# EAGLE schematic main (EAGLE 6.1)
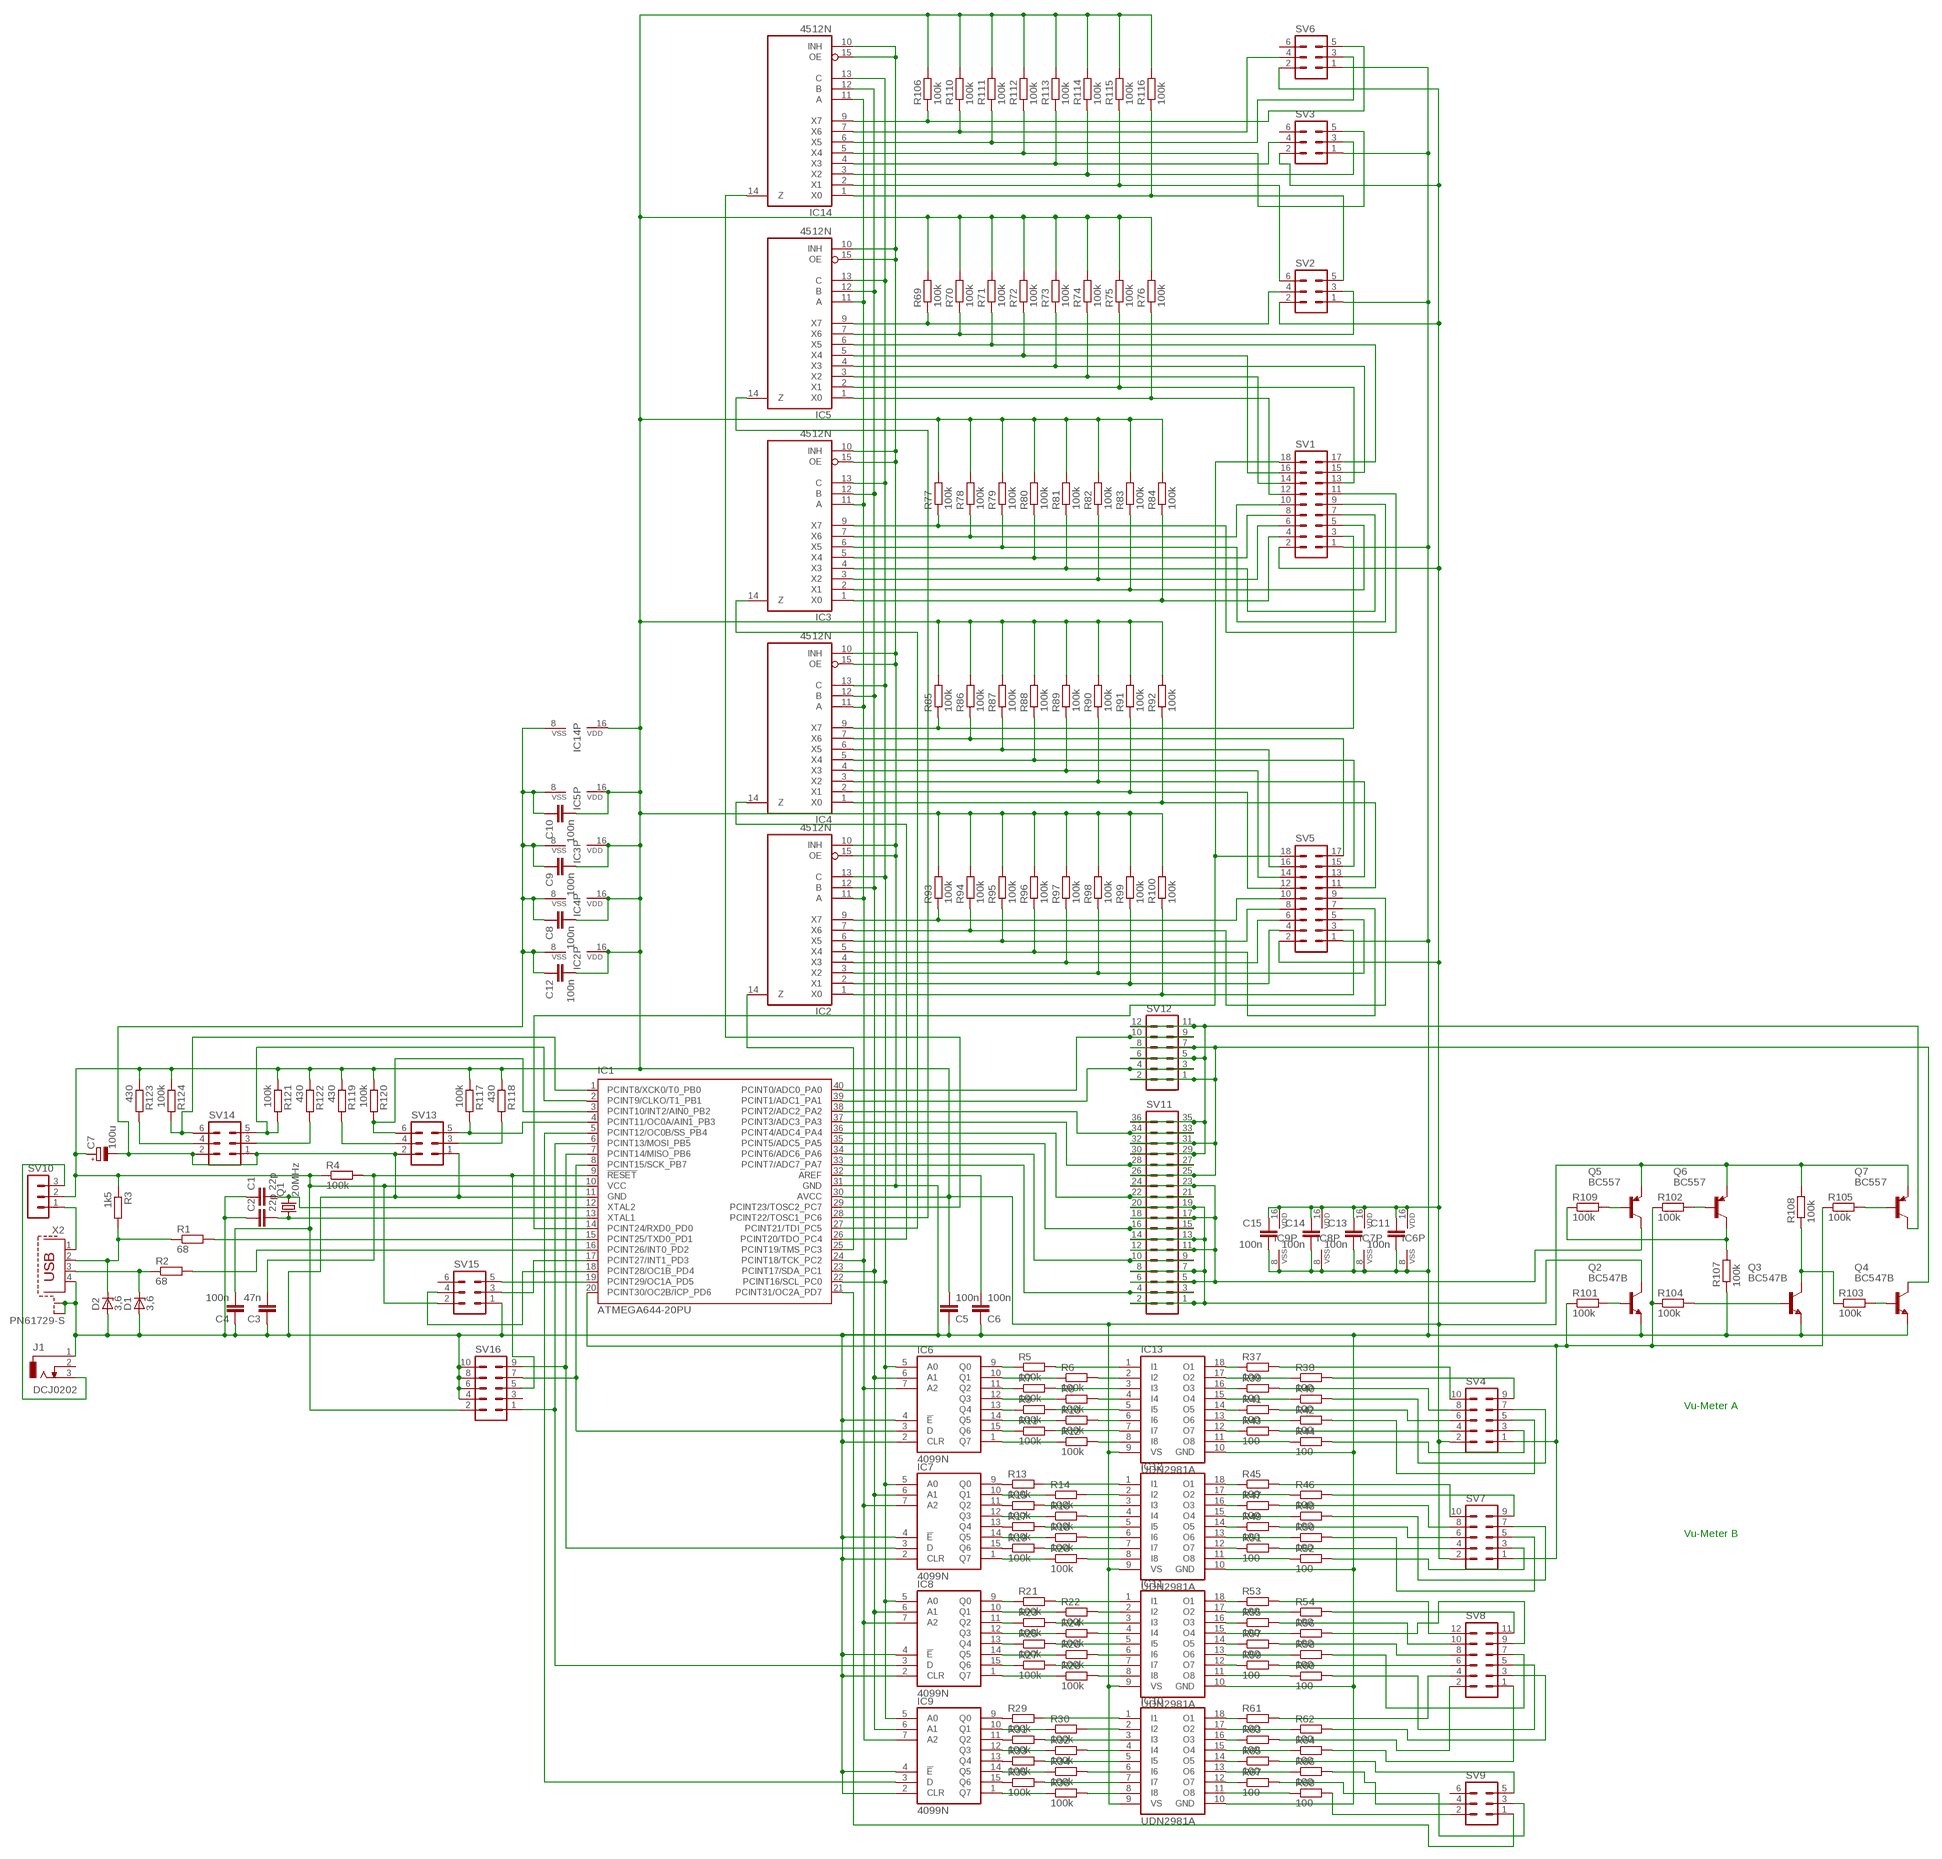
[diagram p0: schematic, sheet 1]

## Parts
C1  22p  C-EU025-024X044  [C025-024X044]
C2  22p  C-EU025-024X044  [C025-024X044]
C3  47n  C-EU025-024X044  [C025-024X044]
C4  100n  C-EU025-024X044  [C025-024X044]
C5  100n  C-EU025-024X044  [C025-024X044]
C6  100n  C-EU025-024X044  [C025-024X044]
C7  100u  CPOL-EUE3.5-8  [E3,5-8]
C8  100n  C-EU025-024X044  [C025-024X044]
C9  100n  C-EU025-024X044  [C025-024X044]
C10  100n  C-EU025-024X044  [C025-024X044]
C11  100n  C-EU025-024X044  [C025-024X044]
C12  100n  C-EU025-024X044  [C025-024X044]
C13  100n  C-EU025-024X044  [C025-024X044]
C14  100n  C-EU025-024X044  [C025-024X044]
C15  100n  C-EU025-024X044  [C025-024X044]
D1  3,6  ZENER-DIODEDO34-7  [DO34Z7]
D2  3,6  ZENER-DIODEDO34-7  [DO34Z7]
IC1  ATMEGA644-20PU  [DIL40]
IC2  4512N  [DIL16]
IC3  4512N  [DIL16]
IC4  4512N  [DIL16]
IC5  4512N  [DIL16]
IC6  4099N  [DIL16]
IC7  4099N  [DIL16]
IC8  4099N  [DIL16]
IC9  4099N  [DIL16]
IC10  UDN2981A  [DIL18]
IC11  UDN2981A  [DIL18]
IC12  UDN2981A  [DIL18]
IC13  UDN2981A  [DIL18]
IC14  4512N  [DIL16]
J1  DCJ0202  [DCJ0202]
Q1  20MHz  CRYSTALHC18U-V  [HC18U-V]
Q2  BC547B  [TO92]
Q3  BC547B  [TO92]
Q4  BC547B  [TO92]
Q5  BC557  [TO92]
Q6  BC557  [TO92]
Q7  BC557  [TO92]
R1  68  R-EU_0204/7  [0204/7]
R2  68  R-EU_0204/7  [0204/7]
R3  1k5  R-EU_0204/7  [0204/7]
R4  100k  R-EU_0204/7  [0204/7]
R5  100k  R-EU_0204/7  [0204/7]
R6  100k  R-EU_0204/7  [0204/7]
R7  100k  R-EU_0204/7  [0204/7]
R8  100k  R-EU_0204/7  [0204/7]
R9  100k  R-EU_0204/7  [0204/7]
R10  100k  R-EU_0204/7  [0204/7]
R11  100k  R-EU_0204/7  [0204/7]
R12  100k  R-EU_0204/7  [0204/7]
R13  100k  R-EU_0204/7  [0204/7]
R14  100k  R-EU_0204/7  [0204/7]
R15  100k  R-EU_0204/7  [0204/7]
R16  100k  R-EU_0204/7  [0204/7]
R17  100k  R-EU_0204/7  [0204/7]
R18  100k  R-EU_0204/7  [0204/7]
R19  100k  R-EU_0204/7  [0204/7]
R20  100k  R-EU_0204/7  [0204/7]
R21  100k  R-EU_0204/7  [0204/7]
R22  100k  R-EU_0204/7  [0204/7]
R23  100k  R-EU_0204/7  [0204/7]
R24  100k  R-EU_0204/7  [0204/7]
R25  100k  R-EU_0204/7  [0204/7]
R26  100k  R-EU_0204/7  [0204/7]
R27  100k  R-EU_0204/7  [0204/7]
R28  100k  R-EU_0204/7  [0204/7]
R29  100k  R-EU_0204/7  [0204/7]
R30  100k  R-EU_0204/7  [0204/7]
R31  100k  R-EU_0204/7  [0204/7]
R32  100k  R-EU_0204/7  [0204/7]
R33  100k  R-EU_0204/7  [0204/7]
R34  100k  R-EU_0204/7  [0204/7]
R35  100k  R-EU_0204/7  [0204/7]
R36  100k  R-EU_0204/7  [0204/7]
R37  100  R-EU_0204/7  [0204/7]
R38  100  R-EU_0204/7  [0204/7]
R39  100  R-EU_0204/7  [0204/7]
R40  100  R-EU_0204/7  [0204/7]
R41  100  R-EU_0204/7  [0204/7]
R42  100  R-EU_0204/7  [0204/7]
R43  100  R-EU_0204/7  [0204/7]
R44  100  R-EU_0204/7  [0204/7]
R45  100  R-EU_0204/7  [0204/7]
R46  100  R-EU_0204/7  [0204/7]
R47  100  R-EU_0204/7  [0204/7]
R48  100  R-EU_0204/7  [0204/7]
R49  100  R-EU_0204/7  [0204/7]
R50  100  R-EU_0204/7  [0204/7]
R51  100  R-EU_0204/7  [0204/7]
R52  100  R-EU_0204/7  [0204/7]
R53  100  R-EU_0204/7  [0204/7]
R54  100  R-EU_0204/7  [0204/7]
R55  100  R-EU_0204/7  [0204/7]
R56  100  R-EU_0204/7  [0204/7]
R57  100  R-EU_0204/7  [0204/7]
R58  100  R-EU_0204/7  [0204/7]
R59  100  R-EU_0204/7  [0204/7]
R60  100  R-EU_0204/7  [0204/7]
R61  100  R-EU_0204/7  [0204/7]
R62  100  R-EU_0204/7  [0204/7]
R63  100  R-EU_0204/7  [0204/7]
R64  100  R-EU_0204/7  [0204/7]
R65  100  R-EU_0204/7  [0204/7]
R66  100  R-EU_0204/7  [0204/7]
R67  100  R-EU_0204/7  [0204/7]
R68  100  R-EU_0204/7  [0204/7]
R69  100k  R-EU_0204/7  [0204/7]
R70  100k  R-EU_0204/7  [0204/7]
R71  100k  R-EU_0204/7  [0204/7]
R72  100k  R-EU_0204/7  [0204/7]
R73  100k  R-EU_0204/7  [0204/7]
R74  100k  R-EU_0204/7  [0204/7]
R75  100k  R-EU_0204/7  [0204/7]
R76  100k  R-EU_0204/7  [0204/7]
R77  100k  R-EU_0204/7  [0204/7]
R78  100k  R-EU_0204/7  [0204/7]
R79  100k  R-EU_0204/7  [0204/7]
R80  100k  R-EU_0204/7  [0204/7]
R81  100k  R-EU_0204/7  [0204/7]
R82  100k  R-EU_0204/7  [0204/7]
R83  100k  R-EU_0204/7  [0204/7]
R84  100k  R-EU_0204/7  [0204/7]
R85  100k  R-EU_0204/7  [0204/7]
R86  100k  R-EU_0204/7  [0204/7]
R87  100k  R-EU_0204/7  [0204/7]
R88  100k  R-EU_0204/7  [0204/7]
R89  100k  R-EU_0204/7  [0204/7]
R90  100k  R-EU_0204/7  [0204/7]
R91  100k  R-EU_0204/7  [0204/7]
R92  100k  R-EU_0204/7  [0204/7]
R93  100k  R-EU_0204/7  [0204/7]
R94  100k  R-EU_0204/7  [0204/7]
R95  100k  R-EU_0204/7  [0204/7]
R96  100k  R-EU_0204/7  [0204/7]
R97  100k  R-EU_0204/7  [0204/7]
R98  100k  R-EU_0204/7  [0204/7]
R99  100k  R-EU_0204/7  [0204/7]
R100  100k  R-EU_0204/7  [0204/7]
R101  100k  R-EU_0204/7  [0204/7]
R102  100k  R-EU_0204/7  [0204/7]
R103  100k  R-EU_0204/7  [0204/7]
R104  100k  R-EU_0204/7  [0204/7]
R105  100k  R-EU_0204/7  [0204/7]
R106  100k  R-EU_0204/7  [0204/7]
R107  100k  R-EU_0204/7  [0204/7]
R108  100k  R-EU_0204/7  [0204/7]
R109  100k  R-EU_0204/7  [0204/7]
R110  100k  R-EU_0204/7  [0204/7]
R111  100k  R-EU_0204/7  [0204/7]
R112  100k  R-EU_0204/7  [0204/7]
R113  100k  R-EU_0204/7  [0204/7]
R114  100k  R-EU_0204/7  [0204/7]
R115  100k  R-EU_0204/7  [0204/7]
R116  100k  R-EU_0204/7  [0204/7]
R117  100k  R-EU_0204/7  [0204/7]
R118  430  R-EU_0204/7  [0204/7]
R119  430  R-EU_0204/7  [0204/7]
R120  100k  R-EU_0204/7  [0204/7]
R121  100k  R-EU_0204/7  [0204/7]
R122  430  R-EU_0204/7  [0204/7]
R123  430  R-EU_0204/7  [0204/7]
R124  100k  R-EU_0204/7  [0204/7]
SV1  MA09-2  [MA09-2]
SV2  MA03-2  [MA03-2]
SV3  MA03-2  [MA03-2]
SV4  MA05-2  [MA05-2]
SV5  MA09-2  [MA09-2]
SV6  MA03-2  [MA03-2]
SV7  MA05-2  [MA05-2]
SV8  MA06-2  [MA06-2]
SV9  MA03-2  [MA03-2]
SV10  MA03-1  [MA03-1]
SV11  MA18-2  [MA18-2]
SV12  MA06-2  [MA06-2]
SV13  MA03-2  [MA03-2]
SV14  MA03-2  [MA03-2]
SV15  MA03-2  [MA03-2]
SV16  MA05-2  [MA05-2]
X2  PN61729-S  [PN61729-S]

## Nets
GND [supply]: C1.1 C2.1 C3.1 C4.1 C5.1 C6.1 C7.- C8.1 C9.1 C10.1 C11.2 C12.1 C13.2 C14.2 C15.2 D1.A D2.A IC1.11(GND) IC1.31(GND) IC2.8(VSS) IC2.10(INH) IC2.15(OE) IC3.8(VSS) IC3.10(INH) IC3.15(OE) IC4.8(VSS) IC4.10(INH) IC4.15(OE) IC5.8(VSS) IC5.10(INH) IC5.15(OE) IC6.2(CLR) IC6.4(!E) IC6.8(VSS) IC7.2(CLR) IC7.4(!E) IC7.8(VSS) IC8.2(CLR) IC8.4(!E) IC8.8(VSS) IC9.2(CLR) IC9.4(!E) IC9.8(VSS) IC10.10(GND) IC11.10(GND) IC12.10(GND) IC13.10(GND) IC14.8(VSS) IC14.10(INH) IC14.15(OE) J1.1 Q2.1(E) Q3.1(E) Q4.1(E) R107.1 SV1.1 SV2.1 SV3.1 SV5.1 SV6.1 SV13.1 SV13.2 SV14.1 SV14.2 SV15.1 SV16.4 SV16.6 SV16.8 SV16.10 X2.4 X2.S1 X2.S2
N$1: IC4.9(X7) R85.1 SV1.3
N$2: C2.2 IC1.13(XTAL1) Q1.1
N$3: C1.2 IC1.12(XTAL2) Q1.2
N$4: IC1.14(PCINT24/RXD0_PD0) SV1.18 SV5.18
N$5: D1.C R2.1 X2.3
N$6: D2.C R1.1 R3.2 X2.2
N$7: IC1.16(PCINT26/INT0_PD2) R2.2
N$8: IC1.15(PCINT25/TXD0_PD1) R1.2
N$9: C3.2 IC1.9(!RESET) R4.2 SV16.5
N$10: IC7.9(Q0) R13.1
N$11: IC7.11(Q2) R15.1
N$12: C6.2 IC1.32(AREF)
N$13: IC7.13(Q4) R17.1
N$14: IC7.15(Q6) R19.1
N$15: IC1.6(PCINT13/MOSI_PB5) IC8.3(D) SV16.1
N$16: IC1.5(PCINT12/OC0B/SS_PB4) IC9.3(D)
N$17: IC1.23(PCINT17/SDA_PC1) IC2.12(B) IC3.12(B) IC4.12(B) IC5.12(B) IC6.6(A1) IC7.6(A1) IC8.6(A1) IC9.6(A1) IC14.12(B)
N$18: IC1.22(PCINT16/SCL_PC0) IC2.13(C) IC3.13(C) IC4.13(C) IC5.13(C) IC6.5(A0) IC7.5(A0) IC8.5(A0) IC9.5(A0) IC14.13(C)
N$19: IC1.24(PCINT18/TCK_PC2) IC2.11(A) IC3.11(A) IC4.11(A) IC5.11(A) IC6.7(A2) IC7.7(A2) IC8.7(A2) IC9.7(A2) IC14.11(A)
N$20: IC8.9(Q0) R21.1
N$21: IC8.10(Q1) R22.1
N$22: IC8.11(Q2) R23.1
N$23: IC8.12(Q3) R24.1
N$24: IC1.27(PCINT21/TDI_PC5) IC3.14(Z)
N$25: IC1.25(PCINT19/TMS_PC3) IC2.14(Z)
N$26: IC3.6(X5) R79.1 SV1.9
N$27: IC3.9(X7) R77.1 SV1.11
N$28: IC12.12(O7) R51.1
N$29: IC8.13(Q4) R25.1
N$30: IC8.14(Q5) R26.1
N$31: IC8.15(Q6) R27.1
N$32: IC8.1(Q7) R28.1
N$33: IC13.8(I8) R12.2
N$34: IC13.7(I7) R11.2
N$35: IC13.6(I6) R10.2
N$36: IC13.5(I5) R9.2
N$37: IC13.4(I4) R8.2
N$38: IC13.3(I3) R7.2
N$39: IC13.2(I2) R6.2
N$40: IC13.1(I1) R5.2
N$41: IC10.1(I1) R29.2
N$42: IC10.2(I2) R30.2
N$43: IC10.3(I3) R31.2
N$44: IC10.4(I4) R32.2
N$45: IC10.5(I5) R33.2
N$46: IC10.6(I6) R34.2
N$47: IC10.7(I7) R35.2
N$48: IC10.8(I8) R36.2
N$49: IC9.10(Q1) R30.1
N$50: IC9.12(Q3) R32.1
N$51: IC9.14(Q5) R34.1
N$52: IC9.1(Q7) R36.1
N$53: IC11.1(I1) R21.2
N$54: IC9.9(Q0) R29.1
N$55: IC9.11(Q2) R31.1
N$56: IC1.28(PCINT22/TOSC1_PC6) IC5.14(Z)
N$57: IC1.26(PCINT20/TDO_PC4) IC4.14(Z)
N$58: IC9.13(Q4) R33.1
N$59: IC11.2(I2) R22.2
N$60: IC9.15(Q6) R35.1
N$61: IC11.3(I3) R23.2
N$62: IC11.4(I4) R24.2
N$63: IC1.8(PCINT15/SCK_PB7) IC6.3(D) SV16.7
N$64: IC1.7(PCINT14/MISO_PB6) IC7.3(D) SV16.9
N$65: IC11.5(I5) R25.2
N$66: IC11.6(I6) R26.2
N$67: IC11.7(I7) R27.2
N$68: IC6.9(Q0) R5.1
N$69: IC6.10(Q1) R6.1
N$70: IC6.11(Q2) R7.1
N$71: IC6.12(Q3) R8.1
N$72: IC6.13(Q4) R9.1
N$73: IC6.14(Q5) R10.1
N$74: IC6.15(Q6) R11.1
N$75: IC6.1(Q7) R12.1
N$76: IC11.8(I8) R28.2
N$77: IC13.18(O1) R37.1
N$78: IC13.17(O2) R38.1
N$79: R37.2 SV4.10
N$80: R38.2 SV4.9
N$81: IC5.9(X7) R69.1 SV2.4
N$82: R53.2 SV8.12
N$83: R39.2 SV4.8
N$84: IC12.1(I1) R13.2
N$85: IC12.2(I2) R14.2
N$86: IC12.3(I3) R15.2
N$87: IC12.4(I4) R16.2
N$88: IC12.5(I5) R17.2
N$89: IC12.6(I6) R18.2
N$90: IC12.7(I7) R19.2
N$91: IC12.8(I8) R20.2
N$92: IC7.10(Q1) R14.1
N$93: IC7.12(Q3) R16.1
N$94: IC13.16(O3) R39.1
N$95: IC13.15(O4) R40.1
N$96: R40.2 SV4.7
N$97: R41.2 SV4.6
N$98: IC5.6(X5) R71.1 SV1.17
N$99: IC7.14(Q5) R18.1
N$100: IC7.1(Q7) R20.1
N$101: IC3.4(X3) R81.1 SV1.7
N$102: IC13.14(O5) R41.1
N$103: IC13.13(O6) R42.1
N$104: R42.2 SV4.5
N$105: R43.2 SV4.4
N$106: IC5.4(X3) R73.1 SV1.15
N$107: IC3.2(X1) R83.1 SV1.5
N$108: IC13.12(O7) R43.1
N$109: IC13.11(O8) R44.1
N$110: IC12.13(O6) R50.1
N$111: IC5.2(X1) R75.1 SV1.13
N$112: R54.2 SV8.11
N$113: IC3.3(X2) R82.1 SV1.6
N$114: IC12.18(O1) R45.1
N$115: IC12.17(O2) R46.1
N$116: R44.2 SV4.3
N$117: J1.3 SV10.3
N$118: IC12.16(O3) R47.1
N$119: IC12.15(O4) R48.1
N$120: R45.2 SV7.10
N$121: R46.2 SV7.9
N$122: IC12.14(O5) R49.1
N$123: IC11.12(O7) R59.1
N$124: R47.2 SV7.8
N$125: R48.2 SV7.7
N$126: R55.2 SV8.10
N$127: R49.2 SV7.6
N$128: R50.2 SV7.5
N$129: IC12.11(O8) R52.1
N$130: R51.2 SV7.4
N$131: IC11.18(O1) R53.1
N$132: IC11.17(O2) R54.1
N$133: R52.2 SV7.3
N$134: IC5.7(X6) R70.1 SV2.3
N$135: IC11.16(O3) R55.1
N$136: IC11.15(O4) R56.1
N$137: IC1.33(PCINT7/ADC7_PA7) SV11.3 SV11.4
N$138: IC3.1(X0) R84.1 SV1.4
N$139: IC11.14(O5) R57.1
N$140: IC11.13(O6) R58.1
N$141: R56.2 SV8.9
N$142: R57.2 SV8.8
N$143: R58.2 SV8.7
N$144: R59.2 SV8.6
N$145: R60.2 SV8.5
N$146: IC11.11(O8) R60.1
N$147: R61.2 SV8.4
N$148: IC10.18(O1) R61.1
N$149: IC10.17(O2) R62.1
N$150: R62.2 SV8.3
N$151: IC1.34(PCINT6/ADC6_PA6) SV11.9 SV11.10
N$152: IC10.16(O3) R63.1
N$153: IC10.15(O4) R64.1
N$154: IC4.7(X6) R86.1 SV5.17
N$155: IC4.6(X5) R87.1 SV5.16
N$156: IC10.14(O5) R65.1
N$157: IC10.13(O6) R66.1
N$158: IC4.5(X4) R88.1 SV5.15
N$159: IC4.4(X3) R89.1 SV5.14
N$160: IC10.12(O7) R67.1
N$161: IC4.3(X2) R90.1 SV5.13
N$162: IC1.29(PCINT23/TOSC2_PC7) IC14.14(Z)
N$163: IC10.11(O8) R68.1
N$164: IC5.5(X4) R72.1 SV1.16
N$165: IC4.2(X1) R91.1 SV5.12
N$166: R63.2 SV8.2
N$167: IC4.1(X0) R92.1 SV5.11
N$168: IC2.9(X7) R93.1 SV5.10
N$169: IC2.7(X6) R94.1 SV5.9
N$170: IC2.6(X5) R95.1 SV5.8
N$171: IC14.9(X7) R106.1 SV6.5
N$172: IC2.5(X4) R96.1 SV5.7
N$173: IC14.7(X6) R110.1 SV6.4
N$174: IC14.6(X5) R111.1 SV6.3
N$175: IC14.4(X3) R113.1 SV3.4
N$176: IC14.2(X1) R115.1 SV2.6
N$177: IC2.4(X3) R97.1 SV5.6
N$178: IC2.3(X2) R98.1 SV5.5
N$179: R64.2 SV8.1
N$180: IC2.2(X1) R99.1 SV5.4
N$181: R65.2 SV9.5
N$182: IC2.1(X0) R100.1 SV5.3
N$183: R66.2 SV9.4
N$184: IC3.7(X6) R78.1 SV1.10
N$185: IC1.20(PCINT30/OC2B/ICP_PD6) R101.1 R102.1 R104.1 R105.1 SV4.1 SV7.1
N$186: Q6.2(B) R102.2
N$187: R67.2 SV9.3
N$188: IC14.5(X4) R112.1 SV3.5
N$189: Q7.2(B) R105.2
N$190: IC14.3(X2) R114.1 SV3.3
N$191: IC14.1(X0) R116.1 SV2.5
N$192: Q2.2(B) R101.2
N$193: R68.2 SV9.2
N$194: IC3.5(X4) R80.1 SV1.8
N$195: Q3.2(B) R104.2
N$196: Q6.3(C) R107.2 R109.1
N$197: Q3.3(C) R103.1 R108.1
N$198: Q4.2(B) R103.2
N$199: Q5.2(B) R109.2
N$200: IC1.21(PCINT31/OC2A_PD7) SV9.1
N$201: IC1.4(PCINT11/OC0A/AIN1_PB3) R117.2 SV13.5
N$202: R118.2 SV13.3
N$203: IC1.3(PCINT10/INT2/AIN0_PB2) R120.2 SV13.6
N$204: IC1.35(PCINT5/ADC5_PA5) SV11.15 SV11.16
N$205: R119.2 SV13.4
N$206: IC1.2(PCINT9/CLKO/T1_PB1) R121.2 SV14.5
N$207: R122.2 SV14.3
N$208: IC1.1(PCINT8/XCK0/T0_PB0) R124.2 SV14.6
N$209: SV10.1 X2.1
N$210: IC1.36(PCINT4/ADC4_PA4) SV11.21 SV11.22
N$211: IC1.37(PCINT3/ADC3_PA3) SV11.27 SV11.28
N$212: R123.2 SV14.4
N$213: IC1.38(PCINT2/ADC2_PA2) SV11.33 SV11.34
N$214: IC5.3(X2) R74.1 SV1.14
N$215: IC1.39(PCINT1/ADC1_PA1) SV12.3 SV12.4
N$216: IC5.1(X0) R76.1 SV1.12
N$217: IC1.40(PCINT0/ADC0_PA0) SV12.9 SV12.10
N$218: Q4.3(C) SV11.25 SV11.26 SV11.31 SV11.32 SV12.1 SV12.2 SV12.7 SV12.8
N$219: IC1.18(PCINT28/OC1B_PD4) SV15.4
N$220: IC1.19(PCINT29/OC1A_PD5) SV15.5
N$221: IC1.17(PCINT27/INT1_PD3) SV15.3
N$237: Q5.3(C) SV11.5 SV11.6 SV11.11 SV11.12 SV11.17 SV11.18 SV11.23 SV11.24
N$238: Q2.3(C) SV11.1 SV11.2 SV11.7 SV11.8 SV11.13 SV11.14 SV11.19 SV11.20
N$251: Q7.3(C) SV11.29 SV11.30 SV11.35 SV11.36 SV12.5 SV12.6 SV12.11 SV12.12
VCC [supply]: C4.2 C5.2 C7.+ C8.2 C9.2 C10.2 C11.1 C12.2 C13.1 C14.1 C15.1 IC1.10(VCC) IC1.30(AVCC) IC2.16(VDD) IC3.16(VDD) IC4.16(VDD) IC5.16(VDD) IC6.16(VDD) IC7.16(VDD) IC8.16(VDD) IC9.16(VDD) IC10.9(VS) IC11.9(VS) IC12.9(VS) IC13.9(VS) IC14.16(VDD) Q5.1(E) Q6.1(E) Q7.1(E) R3.1 R4.1 R69.2 R70.2 R71.2 R72.2 R73.2 R74.2 R75.2 R76.2 R77.2 R78.2 R79.2 R80.2 R81.2 R82.2 R83.2 R84.2 R85.2 R86.2 R87.2 R88.2 R89.2 R90.2 R91.2 R92.2 R93.2 R94.2 R95.2 R96.2 R97.2 R98.2 R99.2 R100.2 R106.2 R108.2 R110.2 R111.2 R112.2 R113.2 R114.2 R115.2 R116.2 R117.1 R118.1 R119.1 R120.1 R121.1 R122.1 R123.1 R124.1 SV1.2 SV2.2 SV3.2 SV4.2 SV5.2 SV6.2 SV7.2 SV10.2 SV15.2 SV16.2
Unconnected: J1.2 SV3.6 SV6.6 SV9.6 SV15.6 SV16.3

## Notes on the sheet
- Vu-Meter A
- Vu-Meter B

## Library data of the parts
C1-C6 C8-C15 = resistor:C-EU: CAPACITOR, European symbol
C7 = resistor:CPOL-EU: POLARIZED CAPACITOR, European symbol
D1 D2 = diode:ZENER-DIODE: Z-Diode
IC1 = atmel:ATMEGA644-*PU: 8-bit Microcontroller with 64K Bytes In-System Programmable Flash Auto generated by make-symbol-device-package-bsdl.ulp Rev. 34 Source: http://www.atmel.com/dyn/resources/prod_documents/doc2593.pdf; MPN: ATMEGA644-20PU; OC_FARNELL: 1288340; OC_NEWARK: 23M5060
IC2-IC5 IC14 = 45xx:4512: 8-channel DATA SELECTOR Inhibit function corrected - 2005.10.04 librarian@cadsoft.de
IC6-IC9 = 40xx:4099: 8-Bit addressable LATCH
IC10-IC13 = uln-udn:UDN298*: DRIVER ARRAY Source: Allegro Microsystems Inc. / UDN2981-UDN2984.pdf
J1 = con-jack:DCJ0202: DC POWER JACK Source: DCJ0202.pdf; OC_FARNELL: unknown; OC_NEWARK: unknown
Q1 = crystal:CRYSTAL: CRYSTAL; OC_FARNELL: unknown; OC_NEWARK: unknown
Q2-Q4 = transistor-npn:BC547*: NPN Transistor
Q5-Q7 = transistor-pnp:BC557: PNP Transistor
R1-R124 = resistor:R-EU_: RESISTOR, European symbol
SV1 SV5 = con-lstb:MA09-2: PIN HEADER; OC_FARNELL: unknown; OC_NEWARK: unknown
SV2 SV3 SV6 SV9 SV13-SV15 = con-lstb:MA03-2: PIN HEADER; OC_FARNELL: unknown; OC_NEWARK: unknown
SV4 SV7 SV16 = con-lstb:MA05-2: PIN HEADER; OC_FARNELL: unknown; OC_NEWARK: unknown
SV8 SV12 = con-lstb:MA06-2: PIN HEADER; OC_FARNELL: unknown; OC_NEWARK: unknown
SV10 = con-lstb:MA03-1: PIN HEADER; OC_FARNELL: unknown; OC_NEWARK: unknown
SV11 = con-lstb:MA18-2: PIN HEADER; OC_FARNELL: unknown; OC_NEWARK: unknown
X2 = con-berg:PN61729-S: BERG USB connector; OC_FARNELL: unknown; OC_NEWARK: unknown

## Net classes
1 supply: width 0.015 mm